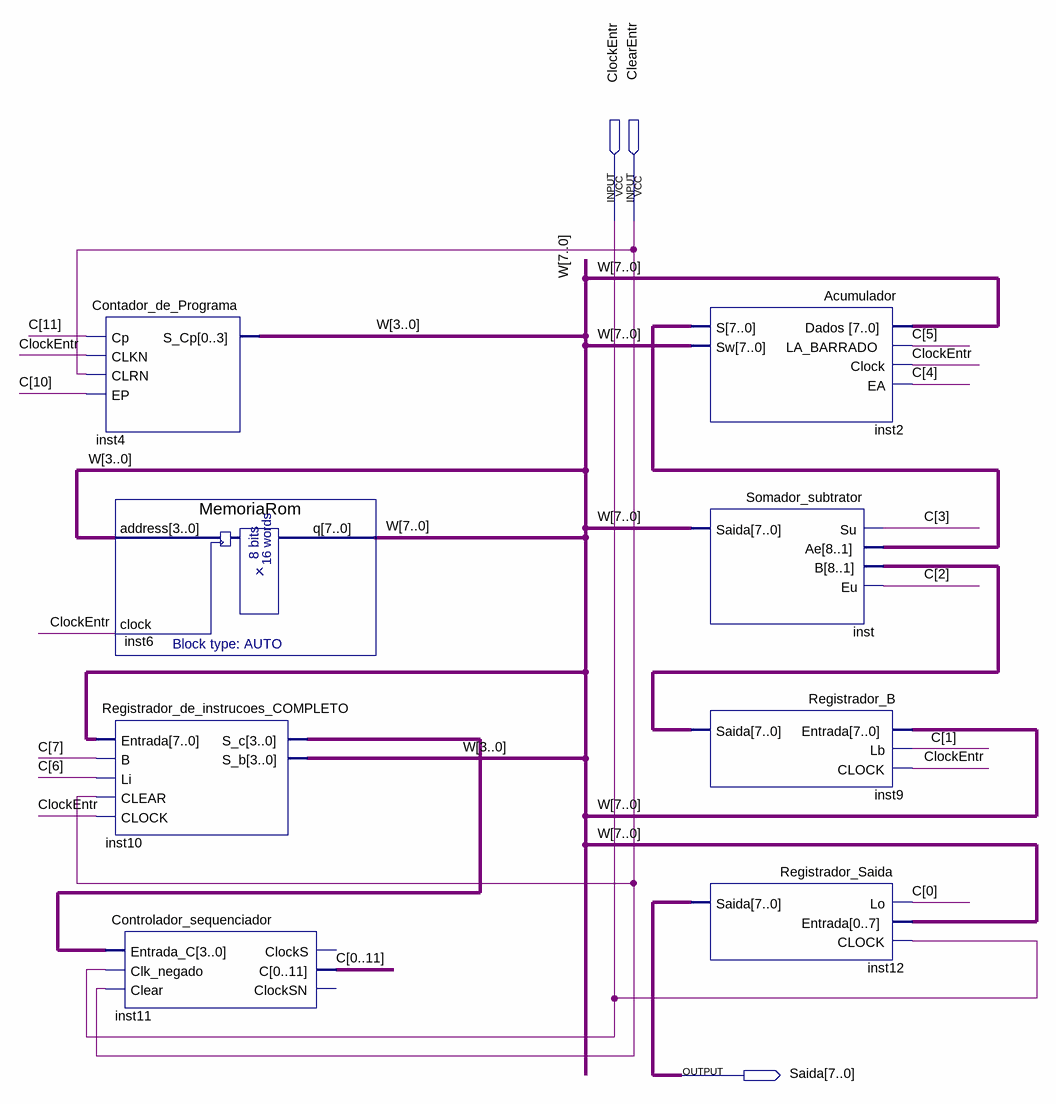
[diagram p0: schematic sheet]
// Quartus schematic Microcontrolador_Projeto_Final.bdf as structural Verilog: 8 symbols, 3 pins
module Microcontrolador_Projeto_Final (
  input  ClockEntr,
  input  ClearEntr,
  output [7:0] Saida
);

  wire [3:0] inst10_s_c;
  wire [7:0] inst2_s, inst9_saida, W;
  wire [11:0] C;

  Contador_de_Programa inst4 (.Cp(C[11]), .CLKN(ClockEntr), .CLRN(ClearEntr), .EP(C[10]), .S_Cp(W[3:0]));
  Registrador_de_instrucoes_COMPLETO inst10 (
    .Entrada(W), .B(C[7]), .Li(C[6]), .CLEAR(ClearEntr), .CLOCK(ClockEntr), .S_c(inst10_s_c), .S_b(W[3:0]));
  MemoriaRom inst6 (.address(W[3:0]), .clock(ClockEntr), .q(W));
  Controlador_sequenciador inst11 (
    .Entrada_C(inst10_s_c), .Clk_negado(ClockEntr), .Clear(ClearEntr),
    .C({C[0], C[1], C[2], C[3], C[4], C[5], C[6], C[7], C[8], C[9], C[10], C[11]}));  // open: ClockS, ClockSN
  Acumulador inst2 (.Dados(W), .LA_BARRADO(C[5]), .Clock(ClockEntr), .EA(C[4]), .S(inst2_s), .Sw(W));
  Somador_subtrator inst (.Su(C[3]), .Ae(inst2_s), .B(inst9_saida), .Eu(C[2]), .Saida(W));
  Registrador_B inst9 (.Entrada(W), .Lb(C[1]), .CLOCK(ClockEntr), .Saida(inst9_saida));
  Registrador_Saida inst12 (.Lo(C[0]), .Entrada(W), .CLOCK(ClockEntr), .Saida(Saida));
endmodule
